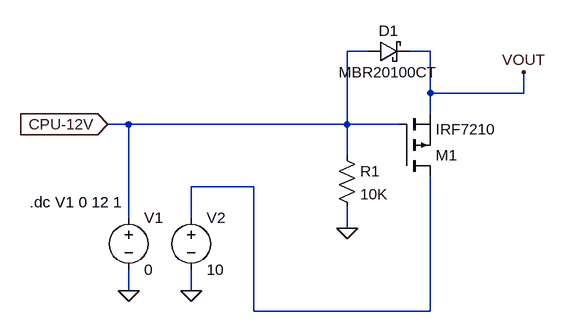
[diagram p0: schematic car-stereo-power.asc]
car-stereo-power.asc, the LTspice schematic file:
Version 4
SHEET 1 880 680
WIRE 128 -144 96 -144
WIRE 224 -144 192 -144
WIRE 224 -80 224 -144
WIRE 368 -80 368 -112
WIRE 368 -80 224 -80
WIRE 224 -48 224 -80
WIRE -240 -32 -272 -32
WIRE 96 -32 96 -144
WIRE 96 -32 -240 -32
WIRE 176 -32 96 -32
WIRE 96 16 96 -32
WIRE -48 64 -144 64
WIRE -240 112 -240 -32
WIRE -144 112 -144 64
WIRE 96 128 96 96
WIRE -240 224 -240 192
WIRE -144 224 -144 192
WIRE -48 256 -48 64
WIRE 224 256 224 48
WIRE 224 256 -48 256
FLAG 96 128 0
FLAG 368 -112 VOUT
FLAG -144 224 0
FLAG -240 224 0
FLAG -272 -32 CPU-12V
IOPIN -272 -32 In
SYMBOL schottky 128 -128 R270
WINDOW 0 32 32 VTop 2
WINDOW 3 0 32 VBottom 2
SYMATTR InstName D1
SYMATTR Value MBR20100CT
SYMBOL res 80 0 R0
SYMATTR InstName R1
SYMATTR Value 10K
SYMBOL voltage -240 96 R0
WINDOW 123 0 0 Left 2
WINDOW 39 0 0 Left 2
SYMATTR InstName V1
SYMATTR Value 0
SYMBOL voltage -144 96 R0
WINDOW 123 0 0 Left 2
WINDOW 39 0 0 Left 2
SYMATTR InstName V2
SYMATTR Value 10
SYMBOL pmos 176 48 M180
SYMATTR InstName M1
SYMATTR Value IRF7210
TEXT -392 88 Left 2 !.dc V1 0 12 1

The netlist it stands for:
* car-stereo-power.asc
D1 CPU-12V VOUT MBR20100CT
R1 CPU-12V 0 10K
V1 CPU-12V 0 0
V2 N001 0 10
M1 N001 CPU-12V VOUT VOUT IRF7210
.model D D
.lib standard.dio
.model NMOS NMOS
.model PMOS PMOS
.lib standard.mos
.dc V1 0 12 1
.backanno
.end